# EAGLE design double-offset (EAGLE 7.7.0)
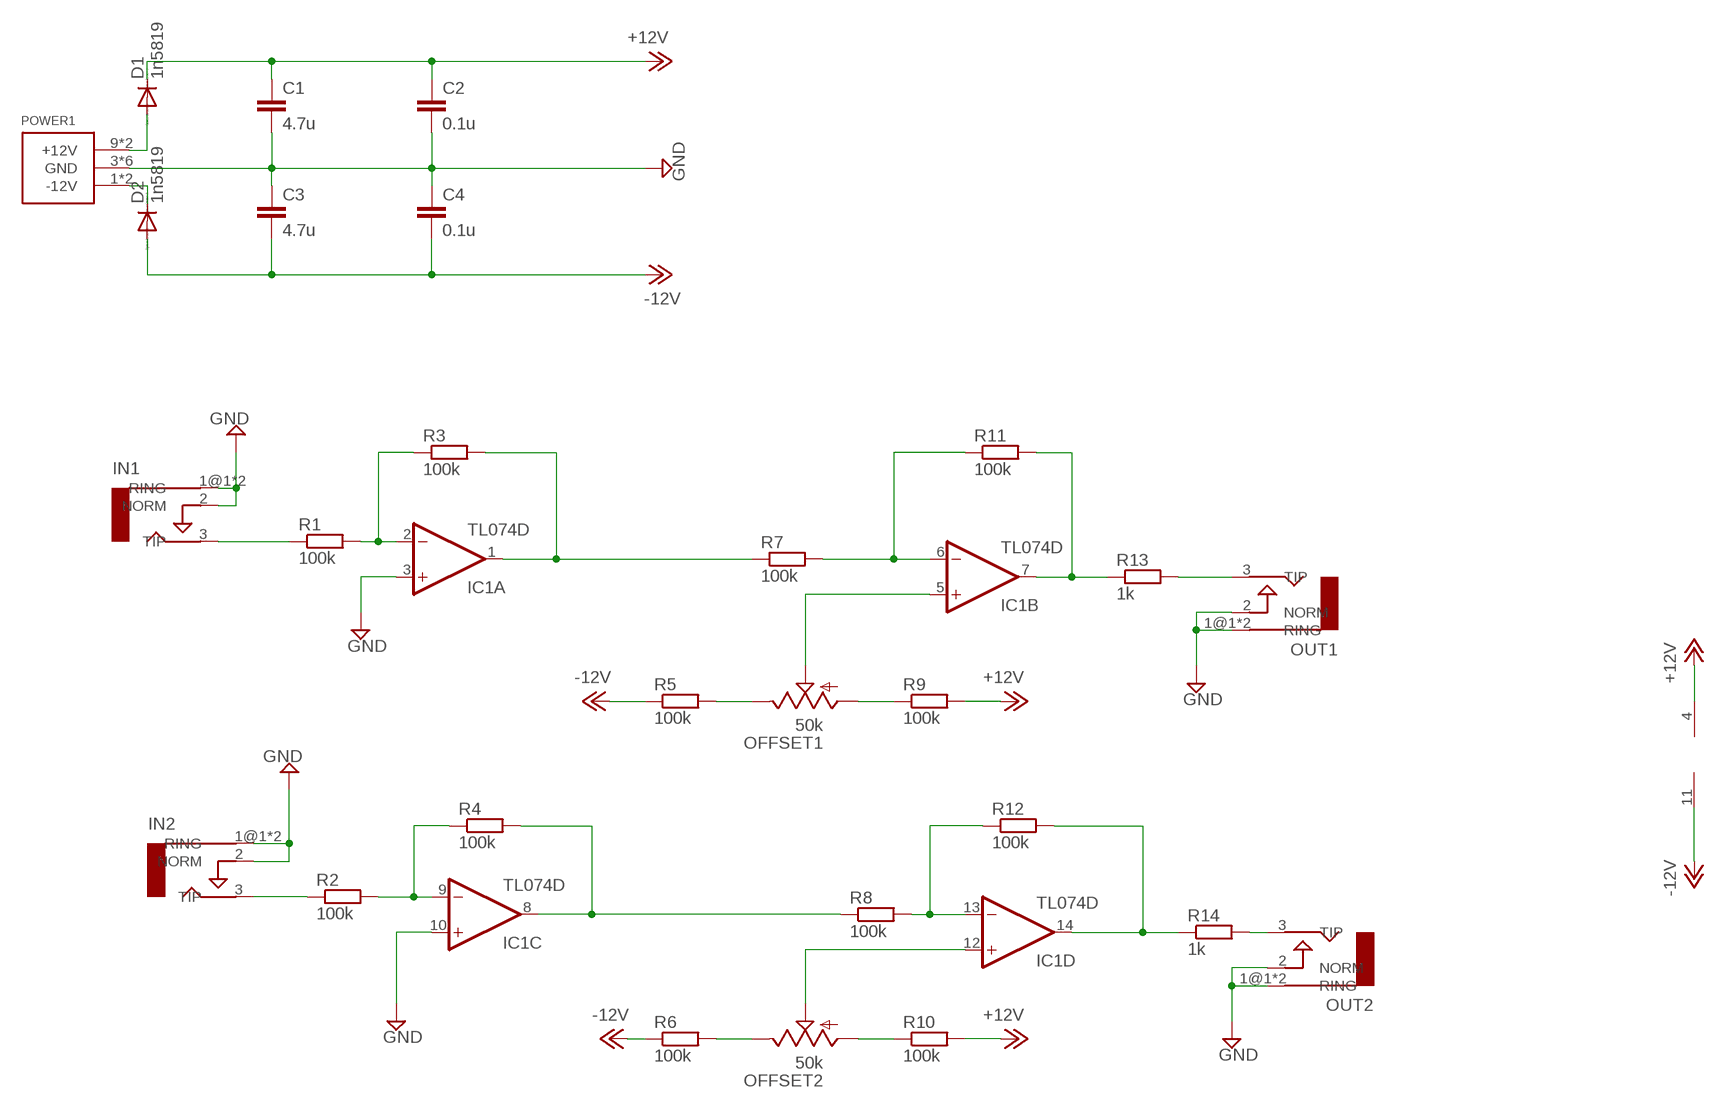
[diagram p0: schematic, sheet 1]

## Parts
C1  4.7u  C-EUC0805  [C0805]
C2  0.1u  C-EUC0805  [C0805]
C3  4.7u  C-EUC0805  [C0805]
C4  0.1u  C-EUC0805  [C0805]
D1  1n5819  DIODE-SOD323-W  [SOD323-W]
D2  1n5819  DIODE-SOD323-W  [SOD323-W]
IC1  TL074D  [SO14]
IN1  AUDIO-JACKERTHENVAR  [ERTHENVAR-JACK]
IN2  AUDIO-JACKERTHENVAR  [ERTHENVAR-JACK]
OFFSET1  50k  9MM_SNAP-IN_POT_  [9MM_SNAP-IN_POT]
OFFSET2  50k  9MM_SNAP-IN_POT_  [9MM_SNAP-IN_POT]
OUT1  AUDIO-JACKERTHENVAR  [ERTHENVAR-JACK]
OUT2  AUDIO-JACKERTHENVAR  [ERTHENVAR-JACK]
POWER1  POWER_SIMPLE10  [POWER_10]
R1  100k  R-EU_R0805  [R0805]
R2  100k  R-EU_R0805  [R0805]
R3  100k  R-EU_R0805  [R0805]
R4  100k  R-EU_R0805  [R0805]
R5  100k  R-EU_R0805  [R0805]
R6  100k  R-EU_R0805  [R0805]
R7  100k  R-EU_R0805  [R0805]
R8  100k  R-EU_R0805  [R0805]
R9  100k  R-EU_R0805  [R0805]
R10  100k  R-EU_R0805  [R0805]
R11  100k  R-EU_R0805  [R0805]
R12  100k  R-EU_R0805  [R0805]
R13  1k  R-EU_R0805  [R0805]
R14  1k  R-EU_R0805  [R0805]

## Nets
+12V: C1.1 C2.1 D1.C IC1.4(P:V+) R9.2 R10.2
-12V: C3.2 C4.2 D2.A IC1.11(P:V-) R5.1 R6.1
GND: C1.2 C2.2 C3.1 C4.1 IC1.3(A:+IN) IC1.10(C:+IN) IN1.1@1(RING) IN1.1@2(RING) IN1.2(NORM) IN2.1@1(RING) IN2.1@2(RING) IN2.2(NORM) OUT1.1@1(RING) OUT1.1@2(RING) OUT1.2(NORM) OUT2.1@1(RING) OUT2.1@2(RING) OUT2.2(NORM) POWER1.3(GND) POWER1.4(GND) POWER1.5(GND) POWER1.6(GND) POWER1.7(GND) POWER1.8(GND)
N$1: IC1.1(A:OUT) R3.2 R7.1
N$2: IC1.6(B:-IN) R7.2 R11.1
N$3: IC1.7(B:OUT) R11.2 R13.1
N$4: OUT1.3(TIP) R13.2
N$5: IC1.2(A:-IN) R1.2 R3.1
N$6: IC1.5(B:+IN) OFFSET1.2(S)
N$7: IC1.13(D:-IN) R8.2 R12.1
N$8: IC1.14(D:OUT) R12.2 R14.1
N$9: IC1.8(C:OUT) R4.2 R8.1
N$10: IC1.9(C:-IN) R2.2 R4.1
N$11: D2.C POWER1.1(-12V) POWER1.2(-12V)
N$12: D1.A POWER1.9(+12V) POWER1.10(+12V)
N$13: IC1.12(D:+IN) OFFSET2.2(S)
N$14: OUT2.3(TIP) R14.2
N$15: OFFSET1.3(E) R5.2
N$16: OFFSET1.1(A) R9.1
N$17: OFFSET2.3(E) R6.2
N$18: OFFSET2.1(A) R10.1
N$23: IN1.3(TIP) R1.1
N$24: IN2.3(TIP) R2.1

## Library data of the parts
C1-C4 = rcl:C-EU: CAPACITOR, European symbol
D1 D2 = diode:DIODE-: DIODE
IC1 = linear:TL074: OP AMP
IN1 IN2 OUT1 OUT2 = erthenvar:AUDIO-JACK: Switching Mono 3.5mm Audio Jack from Erthenvar.
OFFSET1 OFFSET2 = MusicThingModular:9MM_SNAP-IN_POT: 9mm vertical snap-in pot, Alpha / Panasonic style
POWER1 = eurorack:POWER_SIMPLE
R1-R14 = rcl:R-EU_: RESISTOR, European symbol

## Board
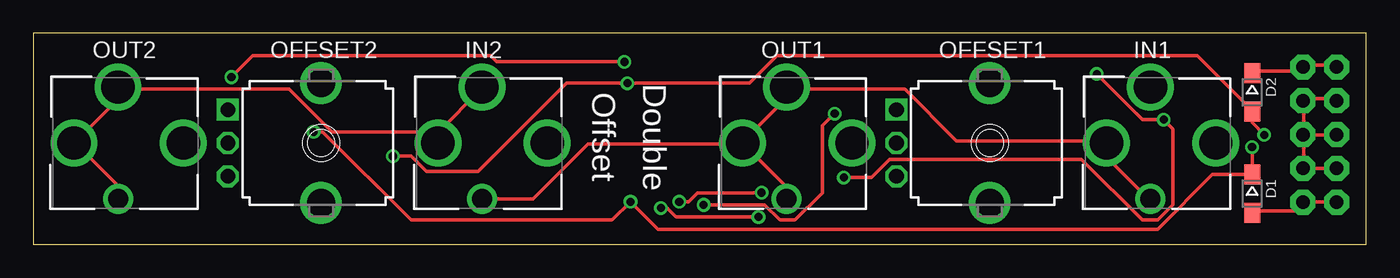
[diagram p1: board, top side]
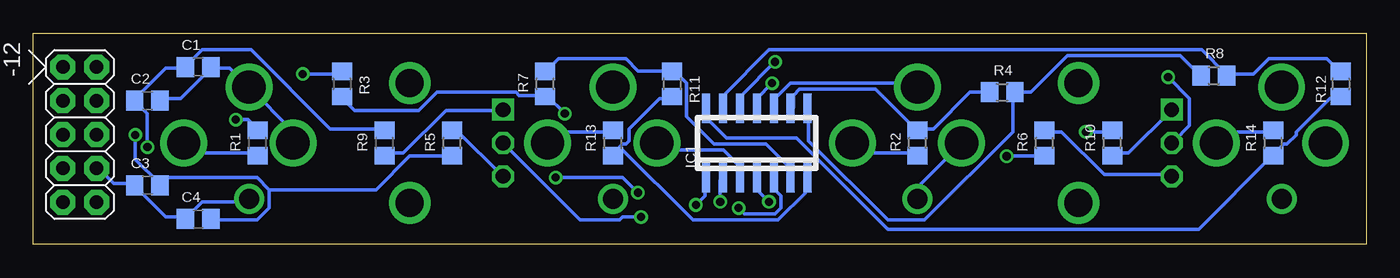
[diagram p2: board, bottom side, seen from below]

Size 100 x 15.87 mm. Coordinates in mm from the lower left corner, seen from the top.
Outline: 0,0 100,0 100,15.87 0,15.87 0,0
Copper layers (1*16): Top 0.035mm / dielectric 1.5mm / Bottom 0.035mm
Design rules "default": minimum track width 10mil, minimum drill 24mil, track to track 8mil, track to pad 8mil, pad to pad 8mil, via to via 8mil, smd to smd 8mil, copper to edge 40mil, drill to drill 8mil, minimum pad ring 10mil, minimum via ring 8mil, stop-mask expansion 4mil, vias tented up to drill 0mil, thermal gap 10mil

### Footprints (pad centres in the part's own frame; a part is rotated, then mirrored left to right if it is on the bottom)
C0805 = smd 1.3 x 1.5: 1 -0.95,0; 2 0.95,0
SOD323-W = smd 1.5 x 1.2: A 1.45,0; C -1.45,0
SO14 = smd 0.6 x 2.2: 1 -3.81,-2.6; 2 -2.54,-2.6; 3 -1.27,-2.6; 4 0,-2.6; 5 1.27,-2.6; 6 2.54,-2.6; 7 3.81,-2.6; 8 3.81,2.6; 9 2.54,2.6; 10 1.27,2.6; 11 0,2.6; 12 -1.27,2.6; 13 -2.54,2.6; 14 -3.81,2.6
ERTHENVAR-JACK = drill 2.5: 1@1 -4.2,0; 2 0,-3.3; 3 0,4.9 | drill 1.5: 1@2 4.2,0
9MM_SNAP-IN_POT = drill 1.1 square: 1 -2.5,-7 | drill 1.1 octagon: 2 0,-7; 3 2.5,-7 | drill 2.1 pad 2.794: CHASSIS1 -4.5,0; CHASSIS2 4.5,0
POWER_10 = drill 1.016 pad 1.88 octagon: 1 -5.08,-1.27; 2 -5.08,1.27; 3 -2.54,-1.27; 4 -2.54,1.27; 5 0,-1.27; 6 0,1.27; 7 2.54,-1.27; 8 2.54,1.27; 9 5.08,-1.27; 10 5.08,1.27
R0805 = smd 1.3 x 1.5: 1 -0.95,0; 2 0.95,0

### Placement (x,y rotation side)
C1  87.63,13.34 0 bottom
C2  91.44,10.79 0 bottom
C3  91.44,4.45 0 bottom
C4  87.63,1.91 0 bottom
D1  91.44,3.81 270 top
D2  91.44,11.43 270 top
IC1  45.72,7.62 0 bottom
IN1  83.82,7.62 270 top
IN2  33.66,7.62 270 top
OFFSET1  71.75,7.62 270 top
OFFSET2  21.59,7.62 270 top
OUT1  56.52,7.62 270 top
OUT2  6.35,7.62 270 top
POWER1  96.52,8.26 270 bottom
R1  83.19,7.62 90 bottom
R2  33.66,7.62 90 bottom
R3  76.83,12.06 270 bottom
R4  27.3,11.43 0 bottom
R5  68.58,7.62 90 bottom
R6  24.13,7.62 90 bottom
R7  61.59,12.06 90 bottom
R8  11.43,12.7 0 bottom
R9  73.66,7.62 90 bottom
R10  19.05,7.62 90 bottom
R11  52.07,12.06 270 bottom
R12  1.91,12.06 270 bottom
R13  56.52,7.62 90 bottom
R14  6.99,7.62 90 bottom

### Tracks (layer width: path | path; a pad name or v marks a point on that pad's centre or on a via)
+12V  (via drill 0.61)
  Top 0.254: v91.44,7.32 D1.C 88.47,5.26 84.35,1.14 46.86,1.14 v44.81,3.2 43.43,1.83 28.35,1.83 21.72,8.46 v21.03,8.46
  Bottom 0.254: v91.44,7.32 91.44,9.83 92.35,10.74 C2.1 92.35,10.97 90.07,13.26 88.7,13.26 C1.1 88.47,13.49 87.33,14.63 83.67,14.63 77.72,8.69 73.84,8.69 R9.2 | v21.03,8.46 19.2,8.46 R10.2 | v44.81,3.2 45.72,4.12 IC1.4
-12V  (via drill 0.61)
  Top 0.254: v26.98,6.63 28.35,6.63 29.49,5.49 33.38,5.49 40.01,12.12 v44.58,12.12 53.72,12.12 55.78,14.17 87.33,14.17 91.44,10.06 D2.A 91.44,9.14 v92.35,8.23
  Bottom 0.254: v26.98,6.63 24.23,6.63 R6.1 | v44.58,12.12 45.72,10.97 IC1.11 | 82.3,4.12 82.3,2.74 83.21,1.83 86.64,1.83 C4.2 | 82.3,4.12 83.21,5.03 89.84,5.03 90.3,4.57 C3.2 90.53,4.57 92.35,6.4 v92.35,8.23 | 82.3,4.12 74.3,4.12 71.78,6.63 68.58,6.63 R5.1
GND
  Top 0.254: 95.33,8.23 97.61,8.23 POWER1.5 | POWER1.3 97.61,10.97 95.33,10.97 POWER1.4 95.33,10.74 95.33,8.46 POWER1.6 95.33,8.23 | 95.33,5.71 POWER1.7 | 95.33,5.71 95.33,8.23 | 95.33,5.71 POWER1.8 | IN1.1@2 83.67,3.43 80.7,6.4 80.7,7.54 IN1.2 80.47,7.77 69.27,7.77 65.38,11.66 56.69,11.66 OUT1.1@1 56.46,11.66 56.46,10.97 53.26,7.77 OUT1.2 | OUT1.1@2 56.46,3.43 56.46,4.34 53.26,7.54 OUT1.2 | OUT2.1@2 6.17,3.43 6.17,4.57 3.2,7.54 OUT2.2 3.2,7.77 6.17,10.74 6.17,11.66 OUT2.1@1 6.4,11.66 19.2,11.66 22.4,8.46 30.4,8.46 | 30.4,8.46 30.4,7.77 IN2.2 30.4,8.46 | 30.4,8.46 33.6,11.66 IN2.1@1 | OUT1.2 53.03,7.54 41.6,7.54 37.49,3.43 33.83,3.43 IN2.1@2
  Bottom 0.254: 86.64,13.26 85.27,13.26 83.9,11.89 IN1.1@1 83.67,11.66 80.7,8.69 80.7,7.77 IN1.2 | 86.64,13.26 88.92,10.97 90.3,10.97 C2.2 | 86.64,13.26 C1.2 | POWER1.8 95.1,5.71 93.95,4.57 92.58,4.57 C3.1 92.35,4.34 90.07,2.06 88.7,2.06 C4.1 88.47,2.06 87.33,3.2 83.9,3.2 IN1.1@2 | IC1.3 47.09,5.03 47.09,5.94 48.23,7.09 52.58,7.09 53.03,7.54 OUT1.2 | IN2.1@2 33.6,3.43 33.6,4.34 30.4,7.54 IN2.2 | IC1.10 44.35,10.29 44.35,10.97 43.2,12.12 34.06,12.12 33.83,11.89 IN2.1@1
N$1  (via drill 0.61)
  Top 0.254: v50.29,2.97 54.86,2.97 56.01,1.83 57.15,1.83 59.21,3.89 59.21,8.91 v60.12,9.83
  Bottom 0.254: R3.2 76.81,10.97 75.89,10.06 71.09,10.06 69.72,11.43 63.78,11.43 63.55,11.2 61.72,11.2 R7.1 61.49,11.2 v60.12,9.83 | v50.29,2.97 49.61,3.66 49.61,4.8 IC1.1
N$2
  Bottom 0.254: R7.2 61.49,13.03 60.58,13.95 55.55,13.95 54.63,13.03 52.12,13.03 R11.1 51.89,13.03 50.98,12.12 50.98,9.6 48.92,7.54 45.03,7.54 43.2,5.71 43.2,5.03 IC1.6
N$3
  Bottom 0.254: 56.01,7.32 55.78,7.54 55.55,7.54 55.32,7.77 55.32,8.69 53.03,10.97 52.12,10.97 R11.2 | 56.01,7.32 56.46,6.86 R13.1 56.01,7.32 | 56.01,7.32 50.52,1.83 44.12,1.83 42.06,3.89 42.06,4.8 IC1.7
N$4
  Bottom 0.254: R13.2 56.69,8.46 60.58,8.46 61.27,7.77 OUT1.3
N$5  (via drill 0.61)
  Top 0.254: v79.78,12.8 83.21,9.37 v84.81,9.37 85.5,8.69 85.5,2.97 84.35,1.83 83.21,1.83 78.64,6.4 64.24,6.4 62.87,5.03 v60.81,5.03 | v48.46,3.2 49.15,3.2 49.84,3.89 v54.63,3.89
  Bottom 0.254: v79.78,12.8 77.04,12.8 R3.1 | v84.81,9.37 83.9,9.37 83.21,8.69 R1.2 | v48.46,3.2 48.46,4.8 IC1.2 | v54.63,3.89 55.78,5.03 v60.81,5.03
N$6  (via drill 0.61)
  Top 0.254: v47.09,2.74 47.55,2.74 48.23,2.06 v54.41,2.06
  Bottom 0.254: v47.09,2.74 46.63,2.29 44.35,2.29 43.89,2.74 43.89,3.66 44.35,4.12 44.35,4.8 IC1.5 | v54.41,2.06 55.78,2.06 56.01,1.83 58.98,1.83 64.69,7.54 OFFSET1.2
N$7
  Bottom 0.254: R12.1 2.06,13.03 2.97,13.95 7.32,13.95 8.46,12.8 10.29,12.8 R8.2 10.52,12.8 12.34,14.63 44.81,14.63 48.23,11.2 48.23,10.29 IC1.13
N$8
  Bottom 0.254: R12.2 2.06,10.97 2.74,10.97 5.26,8.46 5.26,8.23 5.94,7.54 6.17,7.54 6.86,6.86 R14.1 7.09,6.63 12.57,1.14 35.89,1.14 42.75,8 48.01,8 49.38,9.37 49.38,10.06 IC1.14
N$9
  Bottom 0.254: R8.1 12.57,12.8 13.95,14.17 22.4,14.17 25.15,11.43 R4.2 26.52,11.43 26.52,8.46 33.15,1.83 35.89,1.83 41.83,7.77 41.83,10.06 IC1.8
N$10
  Bottom 0.254: R4.1 29.72,11.43 32.46,8.69 33.6,8.69 R2.2 33.83,8.69 36.8,11.66 42.52,11.66 42.98,11.2 42.98,10.29 IC1.9
N$11
  Top 0.254: D2.C 91.44,13.03 94.87,13.03 95.1,13.26 POWER1.2 95.33,13.49 97.61,13.49 POWER1.1
N$12
  Top 0.254: D1.A 91.44,2.52 94.64,2.52 95.1,2.97 POWER1.10 95.33,3.2 97.61,3.2 POWER1.9
N$13  (via drill 0.61)
  Top 0.254: v44.35,13.72 34.75,13.72 34.29,14.17 16.46,14.17 v14.86,12.57
  Bottom 0.254: v44.35,13.72 46.86,11.2 46.86,10.29 IC1.12 | v14.86,12.57 13.26,10.97 13.26,8.91 14.4,7.77 OFFSET2.2
N$14
  Bottom 0.254: R14.2 7.09,8.46 10.52,8.46 11.2,7.77 OUT2.3
N$15
  Bottom 0.254: R5.2 68.58,8.46 68.12,8.46 64.92,5.26 OFFSET1.3
N$16
  Bottom 0.254: R9.1 73.61,6.86 72.24,6.86 69.04,10.06 64.92,10.06 OFFSET1.1
N$17
  Bottom 0.254: R6.2 24,8.46 22.86,8.46 19.66,5.26 14.63,5.26 OFFSET2.3
N$18
  Bottom 0.254: R10.1 18.97,6.86 17.83,6.86 14.63,10.06 OFFSET2.1
N$23
  Bottom 0.254: R1.1 83.21,6.86 88.01,6.86 88.7,7.54 IN1.3
N$24
  Bottom 0.254: R2.1 33.83,6.86 37.72,6.86 38.41,7.54 IN2.3

### Text on the board
tNames: Double | Offset